# Altium schematic sheet Circuit_ECG_Amplifier.schdoc
size 293 x 154 mm
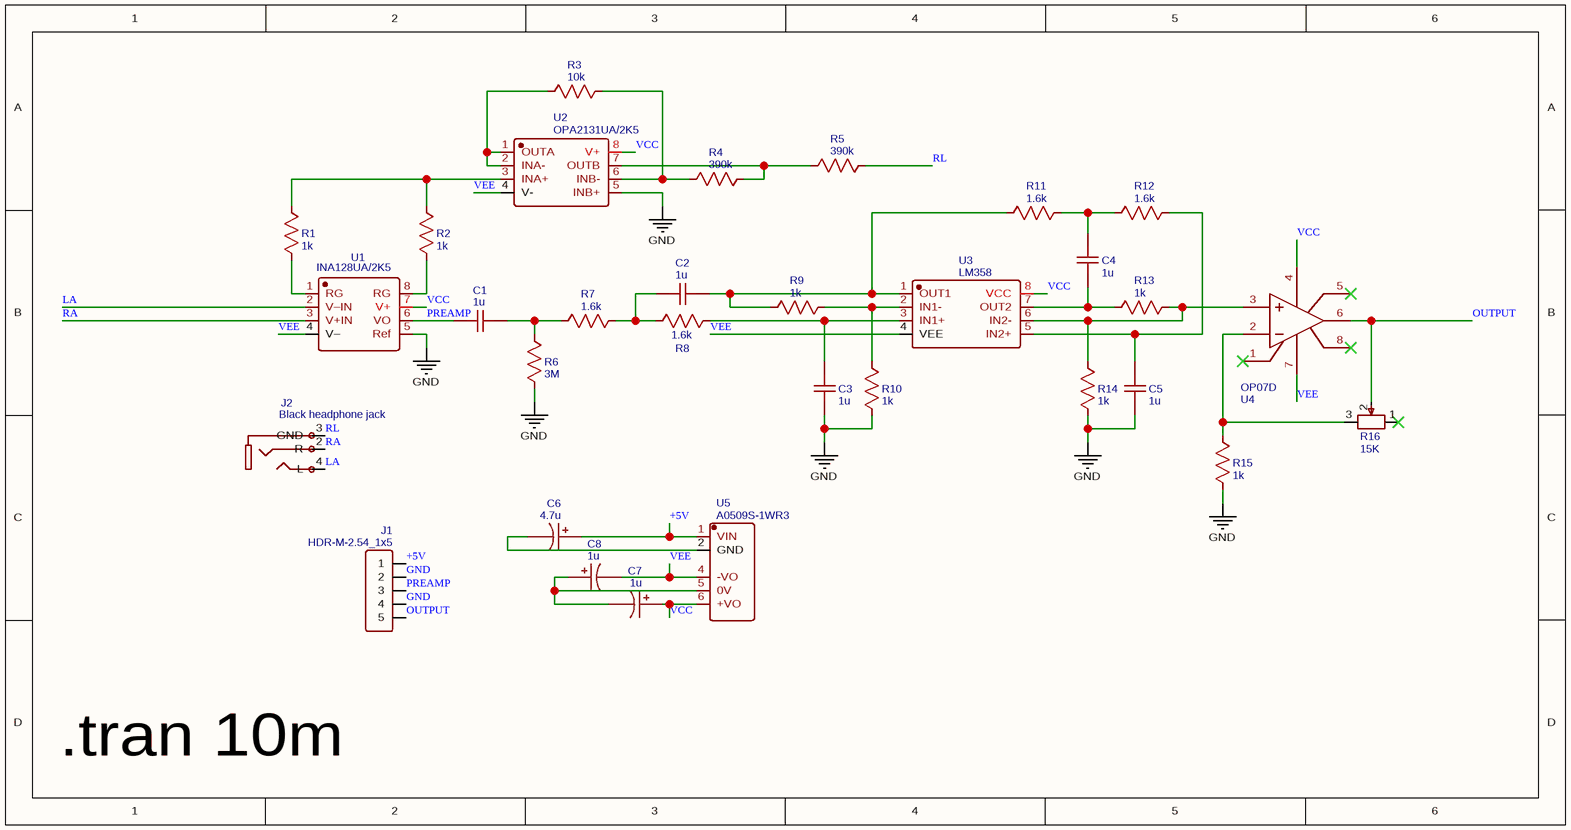
[diagram p0: Circuit_ECG_Amplifier.schdoc]

## Parts
C1  1u  [C1206]
C2  1u  [C1206]
C3  1u  [C1206]
C4  1u  [C1206]
C5  1u  [C1206]
C6  4.7u  [CASE-A_3216]
C7  1u  [CASE-A_3216]
C8  1u  [CASE-A_3216]
J1  HDR-M-2.54_1x5  [HDR-M-2.54_1X5]
J2  Black headphone jack  [AUDIO-PJ320]
R1  1k  [R1206]
R2  1k  [R1206]
R3  10k  [R1206]
R4  390k  [R1206]
R5  390k  [R1206]
R6  3M  [R1206]
R7  1.6k  [R1206]
R8  1.6k  [R1206]
R9  1k  [R1206]
R10  1k  [R1206]
R11  1.6k  [R1206]
R12  1.6k  [R1206]
R13  1k  [R1206]
R14  1k  [R1206]
R15  1k  [R1206]
R16  15K  [RES-ADJ-SMD_VG039NCHXTB153]
U1  INA128UA/2K5  [SOIC-8_L4.9-W3.9-P1.27-LS6.0-BL]
U2  OPA2131UA/2K5  [SOIC-8_L5.0-W4.0-P1.27-LS6.0-BL]
U3  LM358  [SOP-8_L4.9-W3.9-P1.27-LS6.0-BL]
U4  OP07D  [SOP-8_L4.9-W3.9-P1.27-LS6.0-BL]
U5  A0509S-1WR3  [PWRM-TH_A05XXS-1WR3]

## Nets
GND: C3.2 C5.2 J1.2 J1.4 R6.2 R10.2 R14.2 R15.2 U1.5(Ref) U2.5(INB+)
+5V: C6.1 J1.1 U5.1(VIN)
LA: J2.4(L) U1.2(V–IN)
OUTPUT: J1.5 R16.2 U4.6(OUT)
PREAMP: C1.1 J1.3 U1.6(VO)
RA: J2.2(R) U1.3(V+IN)
RL: J2.3(GND) R5.2
VCC: C7.1 U1.7(V+) U2.8(V+) U3.8(VCC) U4.4(VCC-) U5.6(+VO)
VEE: C8.2 U1.4(V–) U2.4(V-) U3.4(VEE) U4.7(VCC+) U5.4(-VO)
NetC1_2: C1.2 R6.1 R7.1
NetC2_1: C2.1 R7.2 R8.1
NetC2_2: C2.2 R9.1 R11.1 U3.1(OUT1)
NetC3_1: C3.1 R8.2 U3.3(IN1+)
NetC4_1: C4.1 R11.2 R12.1
NetC4_2: C4.2 R13.1 U3.7(OUT2)
NetC5_1: C5.1 R12.2 U3.5(IN2+)
NetC6_2: C6.2 U5.2(GND)
NetC7_2: C7.2 C8.1 U5.5(0V)
NetR1_1: R1.1 R2.1 U2.3(INA+)
NetR1_2: R1.2 U1.1(RG)
NetR2_2: R2.2 U1.8(RG)
NetR3_1: R3.1 U2.1(OUTA) U2.2(INA-)
NetR3_2: R3.2 R4.1 U2.6(INB-)
NetR4_2: R4.2 R5.1 U2.7(OUTB)
NetR9_2: R9.2 R10.1 U3.2(IN1-)
NetR13_2: R13.2 R14.1 U3.6(IN2-) U4.3(IN+)
NetR15_1: R15.1 R16.3 U4.2(IN-)

Not connected (* = marked no-connect by the designer): R16 1*; U4 1(OFFSET_N1)* 5(NC)* 8(OFFSET_N2)*

## Notes on the sheet
- .tran 10m

## Library data of the parts
C1-C5 C7 C8 = 1u: nameAlias: Value(F); Contributor: LCEDA_Lib; spicePre: C
  C1-C5: spiceSymbolName: C_1206_US
  C7 C8: spiceSymbolName: C_Tan_SMD_A_US
C6 = 4.7u: nameAlias: Value(F); Contributor: LCEDA_Lib; spicePre: C; spiceSymbolName: C_Tan_SMD_A_US
J1 = HDR-M-2.54_1x5: Contributor: LCEDA_Lib; BOM_Supplier Part: C358687; BOM_Supplier: LCSC; spicePre: J; spiceSymbolName: HDR-M-2.54_1x5
J2 = Black headphone jack: BOM_Manufacturer: BOOMELE; BOM_Supplier: LCSC; BOM_Manufacturer Part: Black headphone jack; image: //image.lceda.cn/szlcsc/C18166.jpg; BOM_Supplier Part: C18166; spicePre: J; spiceSymbolName: Black headphone jack
R1 R2 R9 R10 R13-R15 = 1k: nameAlias: Value(Ω); Contributor: LCEDA_Lib; spicePre: R; spiceSymbolName: R_1206_US
R3 = 10k: nameAlias: Value(Ω); Contributor: LCEDA_Lib; spicePre: R; spiceSymbolName: R_1206_US
R4 R5 = 390k: nameAlias: Value(Ω); Contributor: LCEDA_Lib; spicePre: R; spiceSymbolName: R_1206_US
R6 = 3M: nameAlias: Value(Ω); Contributor: LCEDA_Lib; spicePre: R; spiceSymbolName: R_1206_US
R7 R8 R11 R12 = 1.6k: nameAlias: Value(Ω); Contributor: LCEDA_Lib; spicePre: R; spiceSymbolName: R_1206_US
R16 = 15K: BOM_Manufacturer: Hokuriku Elec Industry; BOM_Manufacturer Part: VG039NCHXTB153; nameAlias: Resistance (Ohms); Contributor: LCSC; BOM_Supplier: LCSC; BOM_Supplier Part: C128547; Resistance(Ohms): 15K; spicePre: R; spiceSymbolName: VG039NCHXTB153
U1 = INA128UA/2K5: BOM_Manufacturer: TI; SMT Type: Extend; BOM_Paste Type: recommend; BOM_Assembly Type: smtWeld; BOM_Supplier: LCSC; BOM_Manufacturer Part: INA128UA/2K5; image: //image.lceda.cn/szlcsc/C22233.jpg; BOM_Supplier Part: C22233; BOM_JLCPCB SMD: Yes; spicePre: U; spiceSymbolName: INA128UA/2K5
U2 = OPA2131UA/2K5: BOM_Manufacturer: Texas Instruments; Contributor: LCSC; BOM_Supplier: LCSC; BOM_Supplier Part: C692898; BOM_Manufacturer Part: OPA2131UA/2K5; spicePre: U; spiceSymbolName: OPA2131UA/2K5
U3 = LM358: BOM_Manufacturer: BLUE ROCKET; Contributor: LCSC; SMT Type: Extend; BOM_Paste Type: expand; BOM_Assembly Type: smtWeld; BOM_Supplier: LCSC; BOM_Supplier Part: C328566; BOM_Manufacturer Part: LM358; BOM_JLCPCB SMD: Yes; spicePre: U; spiceSymbolName: LM358
U4 = OP07D: BOM_Manufacturer: HTC Korea TAEJIN Tech; Contributor: LCSC; BOM_Supplier: LCSC; BOM_Supplier Part: C510565; BOM_Manufacturer Part: OP07D; spicePre: U; spiceSymbolName: OP07D
U5 = A0509S-1WR3: BOM_Manufacturer: MORNSUN; Contributor: LCSC; BOM_Paste Type: expand; BOM_Assembly Type: manualWeld; BOM_Supplier: LCSC; BOM_Manufacturer Part: A0509S-1WR3; BOM_Supplier Part: C131900; spicePre: U; spiceSymbolName: A0509S-1WR3